# Altium schematic sheet LCDTFT_CTRL_BT818.SchDoc
size A3
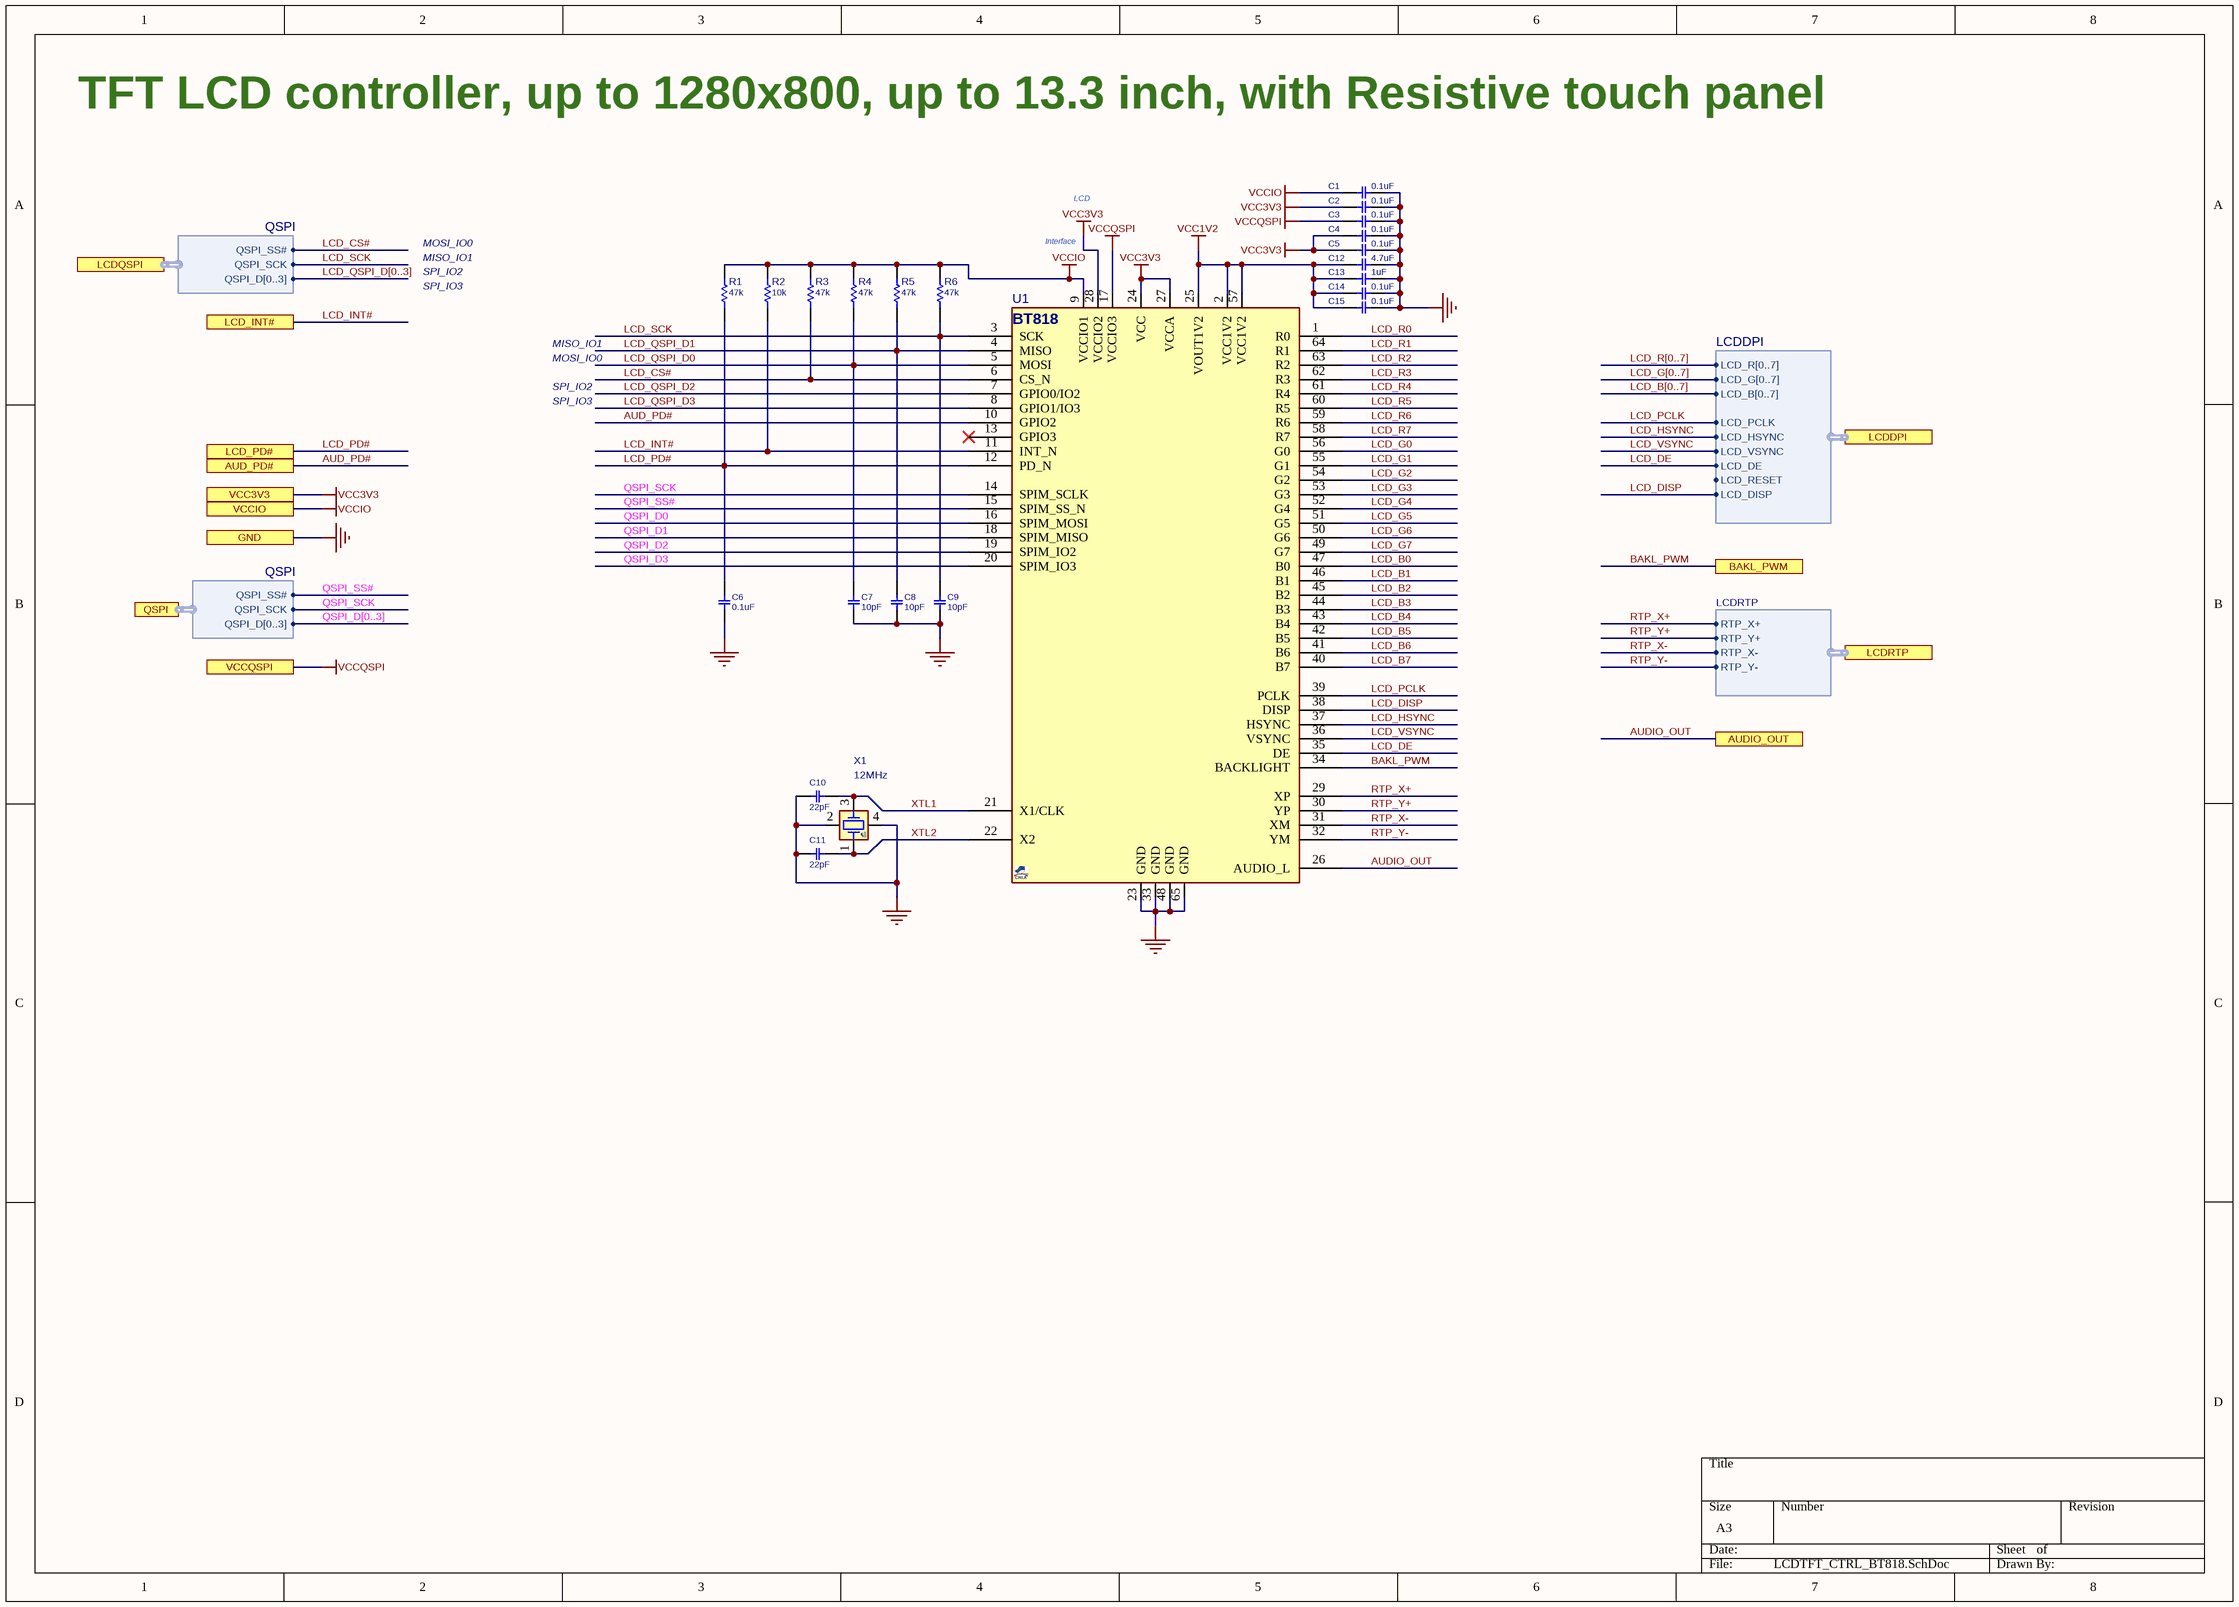
[diagram p0: LCDTFT_CTRL_BT818.SchDoc]

## Parts
C1  0.1uF  [C0402]
C2  0.1uF  [C0402]
C3  0.1uF  [C0402]
C4  0.1uF  [C0402]
C5  0.1uF  [C0402]
C6  0.1uF  [C0402]
C7  10pF  [C0402]
C8  10pF  [C0402]
C9  10pF  [C0402]
C10  22pF  [C0402]
C11  22pF  [C0402]
C12  4.7uF  [C0402]
C13  1uF  [C0402]
C14  0.1uF  [C0402]
C15  0.1uF  [C0402]
R1  47k  [R0402]
R2  10k  [R0402]
R3  47k  [R0402]
R4  47k  [R0402]
R5  47k  [R0402]
R6  47k  [R0402]
U1  BT818  [QFN50_64T]  (value not drawn)
X1  12MHz  [XTL_4_3225]

## Ports
AUD_PD#, AUDIO_OUT, BAKL_PWM, GND, LCD_INT#, LCD_PD#, LCDDPI (harness LCDDPI), LCDQSPI (harness QSPI), LCDRTP (harness LCDRTP), QSPI (harness QSPI), VCC3V3, VCCIO, VCCQSPI

## Harnesses
LCDDPI: LCD_PCLK, LCD_HSYNC, LCD_VSYNC, LCD_DE, LCD_R[0..7], LCD_G[0..7], LCD_B[0..7], LCD_RESET, LCD_DISP
LCDRTP: RTP_X+, RTP_Y+, RTP_X-, RTP_Y-
QSPI: QSPI_SS#, QSPI_SCK, QSPI_D[0..3]

## Nets
GND: C1.1 C2.1 C3.1 C4.1 C5.1 C6.2 C7.2 C8.2 C9.2 C10.1 C11.2 C12.1 C13.1 C14.1 C15.1 U1.23(GND) U1.33(GND) U1.48(GND) U1.65(GND) X1.2 X1.4 ; port GND
VCC1V2: C12.2 C13.2 C14.2 C15.2 U1.2(VCC1V2) U1.25(VOUT1V2) U1.57(VCC1V2)
VCC3V3: C2.2 C4.2 C5.2 U1.24(VCC) U1.27(VCCA) U1.28(VCCIO2) ; port VCC3V3
VCCIO: C1.2 R1.1 R2.1 R3.1 R4.1 R5.1 R6.1 U1.9(VCCIO1) ; port VCCIO
VCCQSPI: C3.2 U1.17(VCCIO3) ; port VCCQSPI
AUD_PD#: U1.10(GPIO2) ; port AUD_PD#
AUDIO_OUT: U1.26(AUDIO_L) ; port AUDIO_OUT
BAKL_PWM: U1.34(BACKLIGHT) ; port BAKL_PWM
LCD_B0: U1.47(B0)
LCD_B1: U1.46(B1)
LCD_B2: U1.45(B2)
LCD_B3: U1.44(B3)
LCD_B4: U1.43(B4)
LCD_B5: U1.42(B5)
LCD_B6: U1.41(B6)
LCD_B7: U1.40(B7)
LCD_CS#: R3.2 U1.6(CS_N) ; port LCDQSPI.QSPI_SS#
LCD_DE: U1.35(DE) ; port LCDDPI.LCD_DE
LCD_DISP: U1.38(DISP) ; port LCDDPI.LCD_DISP
LCD_G0: U1.56(G0)
LCD_G1: U1.55(G1)
LCD_G2: U1.54(G2)
LCD_G3: U1.53(G3)
LCD_G4: U1.52(G4)
LCD_G5: U1.51(G5)
LCD_G6: U1.50(G6)
LCD_G7: U1.49(G7)
LCD_HSYNC: U1.37(HSYNC) ; port LCDDPI.LCD_HSYNC
LCD_INT#: R2.2 U1.11(INT_N) ; port LCD_INT#
LCD_PCLK: U1.39(PCLK) ; port LCDDPI.LCD_PCLK
LCD_PD#: C6.1 R1.2 U1.12(PD_N) ; port LCD_PD#
LCD_QSPI_D0: C7.1 R4.2 U1.5(MOSI)
LCD_QSPI_D1: C8.1 R5.2 U1.4(MISO)
LCD_QSPI_D2: U1.7(GPIO0/IO2)
LCD_QSPI_D3: U1.8(GPIO1/IO3)
LCD_R0: U1.1(R0)
LCD_R1: U1.64(R1)
LCD_R2: U1.63(R2)
LCD_R3: U1.62(R3)
LCD_R4: U1.61(R4)
LCD_R5: U1.60(R5)
LCD_R6: U1.59(R6)
LCD_R7: U1.58(R7)
LCD_SCK: C9.1 R6.2 U1.3(SCK) ; port LCDQSPI.QSPI_SCK
LCD_VSYNC: U1.36(VSYNC) ; port LCDDPI.LCD_VSYNC
QSPI_D0: U1.16(SPIM_MOSI)
QSPI_D1: U1.18(SPIM_MISO)
QSPI_D2: U1.19(SPIM_IO2)
QSPI_D3: U1.20(SPIM_IO3)
QSPI_SCK: U1.14(SPIM_SCLK) ; port QSPI.QSPI_SCK
QSPI_SS#: U1.15(SPIM_SS_N) ; port QSPI.QSPI_SS#
RTP_X+: U1.29(XP) ; port LCDRTP.RTP_X+
RTP_X-: U1.31(XM) ; port LCDRTP.RTP_X-
RTP_Y+: U1.30(YP) ; port LCDRTP.RTP_Y+
RTP_Y-: U1.32(YM) ; port LCDRTP.RTP_Y-
XTL1: C10.2 U1.21(X1/CLK) X1.3
XTL2: C11.1 U1.22(X2) X1.1

Not connected (* = marked no-connect by the designer): U1 13(GPIO3)*

## Buses and harness runs
bus LCD_B[0..7]
bus LCD_G[0..7]
bus LCD_QSPI_D[0..3]
bus LCD_R[0..7]
bus QSPI_D[0..3]

## Notes on the sheet
- TFT LCD controller, up to 1280x800, up to 13.3 inch, with Resistive touch panel
- MOSI_IO0
- MISO_IO1
- Interface
- LCD
- SPI_IO2
- SPI_IO3
- (near U1) 1.8/2.5/3.3v

## Library data of the parts
C1-C6 C14 C15 = CAP_SMD_MLCC: CAP, MLCC; PARAM: X7R, 10%, -55~125oC; MANF_P#: GRM155R71H104KE14D; MANF: Murata; PARAM2: 50v; PRICE: 100: 0.018$; ASSEMBLY: ASSEMBLY; VALUE: 0.1uF
C7-C11 = CAP_SMD_MLCC: CAP, MLCC; PARAM2: 50v; PARAM: -; PRICE: 100: 0.018$; MANF_P#: -; MANF: -; ASSEMBLY: ASSEMBLY
  C7-C9: VALUE: 10pF
  C10 C11: VALUE: 22pF
C12 C13 = CAP_SMD_MLCC: CAP, MLCC; PARAM: X5R, 10%; PRICE: 50,000:	$0.006; MANF_P#: -; MANF: -; PARAM2: -; ASSEMBLY: ASSEMBLY
  C12: VALUE: 4.7uF
  C13: VALUE: 1uF
R1-R6 = RES_SMD: RESISTOR, SMD; PARAM: 0.063W; DESC: DESCRIPTION; DIST#: MOUSER; PARAM2: 1%; MANF_P#: -; MANF: -; ASSEMBLY: ASSEMBLY; PRICE: 100= 0.3$
  R1 R3-R6: VALUE: 47k
  R2: VALUE: 10k
U1 = BT818_QFN64: LCD Display Controller, Embedded Video Engine, 1280X800, QFN-64; MANF: FTDI/Bridgetek; MANF_P#: BT818Q; PARAM2: 1.8~3.3Vcc; PARAM: -40~85°C; PRICE: 5$; VALUE: BT818
X1 = XTL_4_12MHz_3225: Crystal 12MHz; MANF: ECS; MANF_P#: ECS-120-18-33-JEM-TR; PARAM: 20PPM, 18pF; PRICE: 0.5$; VALUE: 12MHz